# EAGLE design incubator (EAGLE 5.11)
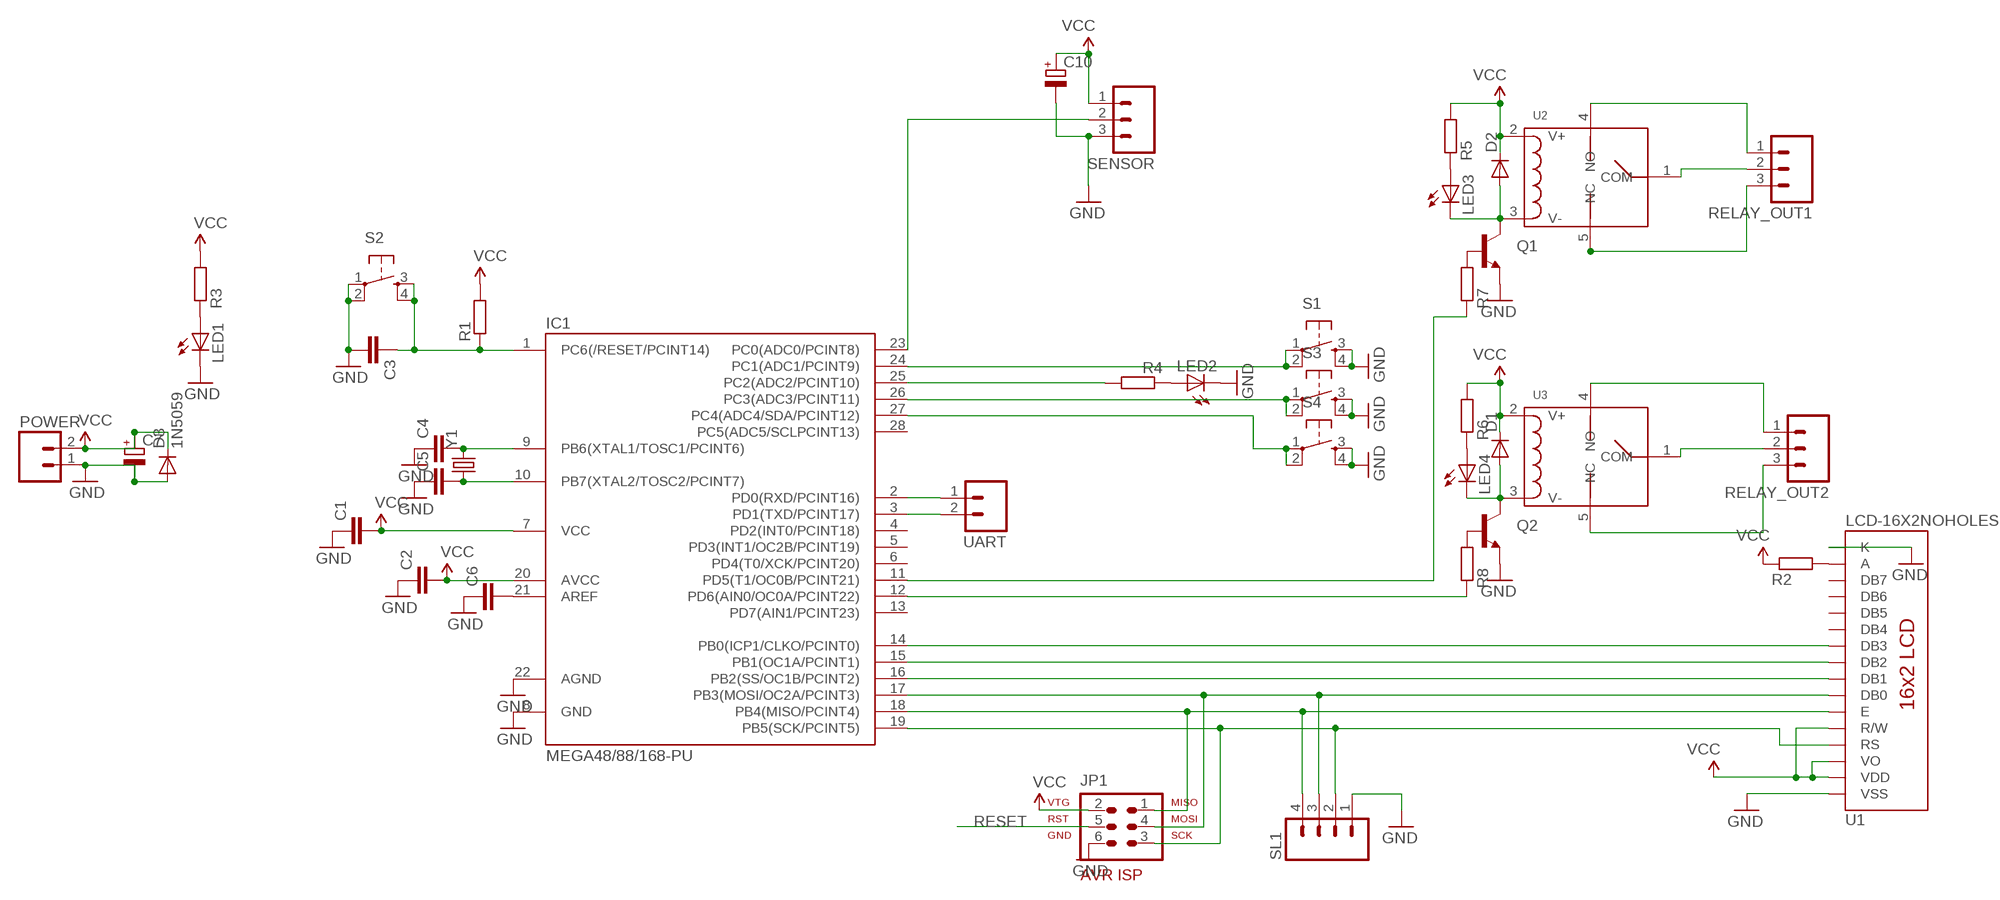
[diagram p0: schematic, sheet 1]

## Parts
C1  C-EUC0603  [C0603]
C2  C-EUC0603  [C0603]
C3  C-EUC0603  [C0603]
C4  C-EUC0805  [C0805]
C5  C-EUC0805  [C0805]
C6  C-EUC0603  [C0603]
C7  CPOL-EUE5-8.5  [E5-8,5]
C10  CPOL-EUE5-8.5  [E5-8,5]
D1  DIODE-MICROMELF-W  [MICROMELF-W]
D2  DIODE-MICROMELF-W  [MICROMELF-W]
D3  1N5059  [DO204-10]
IC1  MEGA48/88/168-PU  [DIL28-3]
JP1  AVR-ISP-6  [AVR-ISP-6]
LED1  LED5MM  [LED5MM]
LED2  LED5MM  [LED5MM]
LED3  LED5MM  [LED5MM]
LED4  LED5MM  [LED5MM]
POWER  M02PTH3  [1X02_LONGPADS]
Q1  TRANSISTOR_NPNSOT23  [SOT23]
Q2  TRANSISTOR_NPNSOT23  [SOT23]
R1  R-EU_R0603  [R0603]
R2  R-EU_R0805  [R0805]
R3  R-EU_R0805  [R0805]
R4  R-EU_R0805  [R0805]
R5  R-EU_R0805  [R0805]
R6  R-EU_R0805  [R0805]
R7  R-EU_R0805  [R0805]
R8  R-EU_R0805  [R0805]
RELAY_OUT1  M03LONGPADS  [1X03_LONGPADS]
RELAY_OUT2  M03LONGPADS  [1X03_LONGPADS]
S1  TAC_SWITCHPTH  [TACTILE-PTH]
S2  TAC_SWITCHPTH  [TACTILE-PTH]
S3  TAC_SWITCHPTH  [TACTILE-PTH]
S4  TAC_SWITCHPTH  [TACTILE-PTH]
SENSOR  M03LONGPADS  [1X03_LONGPADS]
SL1  M04  [04P]
U1  LCD-16X2NOHOLES  [LCD-16X2_NOHOLES]
U2  RELAY  [5P-17X21.6]
U3  RELAY  [5P-17X21.6]
UART  M02PTH3  [1X02_LONGPADS]
Y1  CRYSTALHC49US  [HC49US]

## Nets
GND: C1.1 C2.1 C3.2 C4.1 C5.1 C6.1 C7.- C10.- D3.A IC1.8(GND) IC1.22(AGND) JP1.6 LED1.K(C) LED2.K(C) POWER.1 Q1.2(E) Q2.2(E) S1.3 S1.4 S2.1 S2.2 S3.3 S3.4 S4.3 S4.4 SENSOR.3 SL1.1 U1.1(VSS) U1.16(K)
MISO: IC1.18(PB4(MISO/PCINT4)) JP1.1 SL1.4 U1.6(E)
MOSI: IC1.17(PB3(MOSI/OC2A/PCINT3)) JP1.4 SL1.3 U1.7(DB0)
N$1: IC1.24(PC1(ADC1/PCINT9)) S1.1 S1.2
N$2: C4.2 IC1.9(PB6(XTAL1/TOSC1/PCINT6)) Y1.2
N$3: C5.2 IC1.10(PB7(XTAL2/TOSC2/PCINT7)) Y1.1
N$4: R2.2 U1.15(A)
N$5: C6.2 IC1.21(AREF)
N$9: IC1.16(PB2(SS/OC1B/PCINT2)) U1.8(DB1)
N$10: IC1.15(PB1(OC1A/PCINT1)) U1.9(DB2)
N$11: IC1.14(PB0(ICP1/CLKO/PCINT0)) U1.10(DB3)
N$12: LED1.A R3.1
N$16: IC1.11(PD5(T1/OC0B/PCINT21)) R7.1
N$17: IC1.12(PD6(AIN0/OC0A/PCINT22)) R8.1
N$18: D1.A LED4.K(C) Q2.3(C) U3.3(V-)
N$19: D2.A LED3.K(C) Q1.3(C) U2.3(V-)
N$20: RELAY_OUT1.2 U2.1(COM)
N$21: RELAY_OUT1.1 U2.4(NO)
N$22: RELAY_OUT1.3 U2.5(NC)
N$23: RELAY_OUT2.2 U3.1(COM)
N$24: RELAY_OUT2.1 U3.4(NO)
N$25: RELAY_OUT2.3 U3.5(NC)
N$26: LED2.A R4.1
N$28: LED3.A R5.1
N$29: LED4.A R6.1
N$30: IC1.26(PC3(ADC3/PCINT11)) S3.1 S3.2
N$31: IC1.27(PC4(ADC4/SDA/PCINT12)) S4.1 S4.2
N$32: Q1.1(B) R7.2
N$33: Q2.1(B) R8.2
RESET: C3.1 IC1.1(PC6(/RESET/PCINT14)) JP1.5 R1.1 S2.3 S2.4
RX: IC1.2(PD0(RXD/PCINT16)) UART.1
SCK: IC1.19(PB5(SCK/PCINT5)) JP1.3 SL1.2 U1.4(RS)
STATUS_LED: IC1.25(PC2(ADC2/PCINT10)) R4.2
TEMPERATURE: IC1.23(PC0(ADC0/PCINT8)) SENSOR.2
TX: IC1.3(PD1(TXD/PCINT17)) UART.2
VCC: C1.2 C2.2 C7.+ C10.+ D1.C D2.C D3.C IC1.7(VCC) IC1.20(AVCC) JP1.2 POWER.2 R1.2 R2.1 R3.2 R5.2 R6.2 SENSOR.1 U1.2(VDD) U1.3(VO) U1.5(R/W) U2.2(V+) U3.2(V+)
Unconnected: IC1.4(PD2(INT0/PCINT18)) IC1.5(PD3(INT1/OC2B/PCINT19)) IC1.6(PD4(T0/XCK/PCINT20)) IC1.13(PD7(AIN1/PCINT23)) IC1.28(PC5(ADC5/SCLPCINT13)) U1.11(DB4) U1.12(DB5) U1.13(DB6) U1.14(DB7)

## Library data of the parts
C1-C6 = resistor:C-EU: CAPACITOR, European symbol
C7 C10 = rcl:CPOL-EU: POLARIZED CAPACITOR, European symbol
D1 D2 = diode:DIODE-: DIODE
D3 = diode:1N5059: DIODE controlled avalanche rectifier
IC1 = avr-7:MEGA48/88/168-PU
JP1 = avr-5:AVR-ISP-6: AVR ISP-6 Serial Programming Header
LED1-LED4 = SparkFun:LED: LEDs Standard schematic elements and footprints for 5mm, 3mm, 1206, and 0603 sized LEDs. 5mm - Spark Fun Electronics SKU : COM-00529 (and others)
POWER UART = SparkFun:M02: Header 2 Standard 2-pin 0.1" header. Use with straight break away headers (SKU : PRT-00116), right angle break away headers (PRT-00553), swiss pins (PRT-00743), machine pins (PRT-00117), and female headers (PRT-00115). Molex polarized connector foot print use with SKU : PRT-08233 with associated crimp pins and housings.
Q1 Q2 = SparkFun:TRANSISTOR_NPN: Transistor NPN BJT configuration in SOT23 package. MMBT2222 is the common NPN we use. Double check BCE configuration again layout.
R1-R8 = rcl:R-EU_: RESISTOR, European symbol
RELAY_OUT1 RELAY_OUT2 SENSOR = SparkFun:M03: Header 3 Standard 3-pin 0.1" header. Use with straight break away headers (SKU : PRT-00116), right angle break away headers (PRT-00553), swiss pins (PRT-00743), machine pins (PRT-00117), and female headers (PRT-00115). Molex polarized connector foot print use with SKU : PRT-08232 with associated crimp pins and housings.
S1-S4 = SparkFun:TAC_SWITCH: Momentary Switch Button commonly used for reset or general input. Spark Fun Electronics SKU : COM-00097
SL1 = con-amp-quick:M04: AMP QUICK CONNECTOR; OC_FARNELL: unknown; OC_NEWARK: unknown
U1 = SparkFun:LCD-16X2
U2 U3 = Seeed-Discrete:RELAY
Y1 = SparkFun:CRYSTAL: Crystals Various standard crystals. Proven footprints. Spark Fun Electronics SKU : COM-00534

## Board
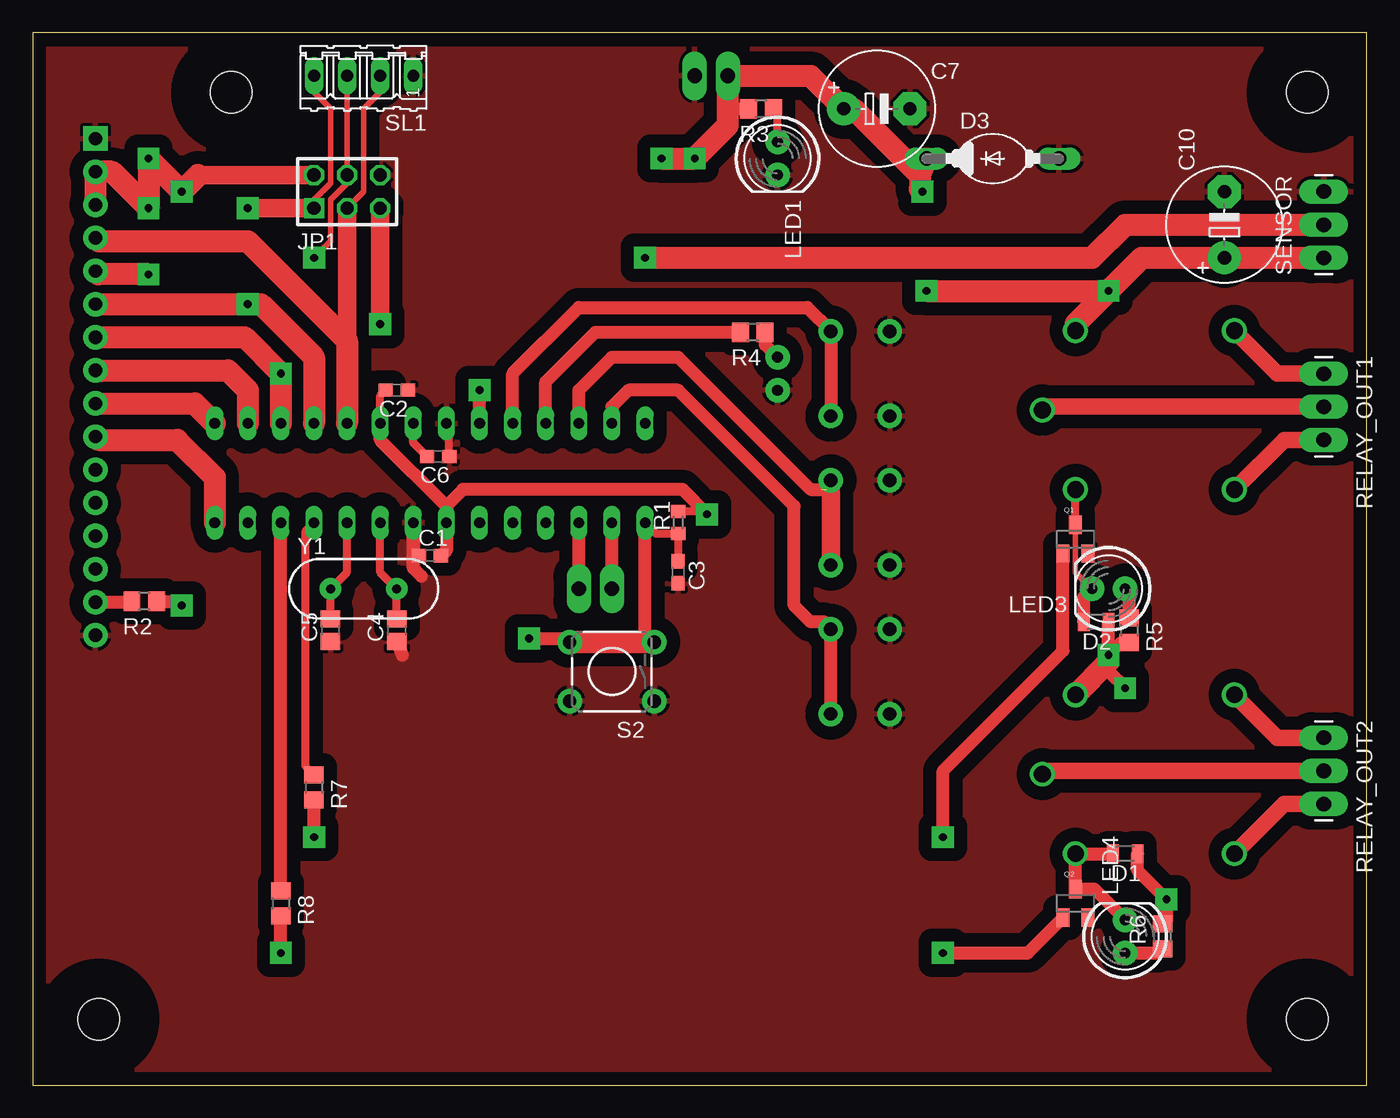
[diagram p1: board, top side]
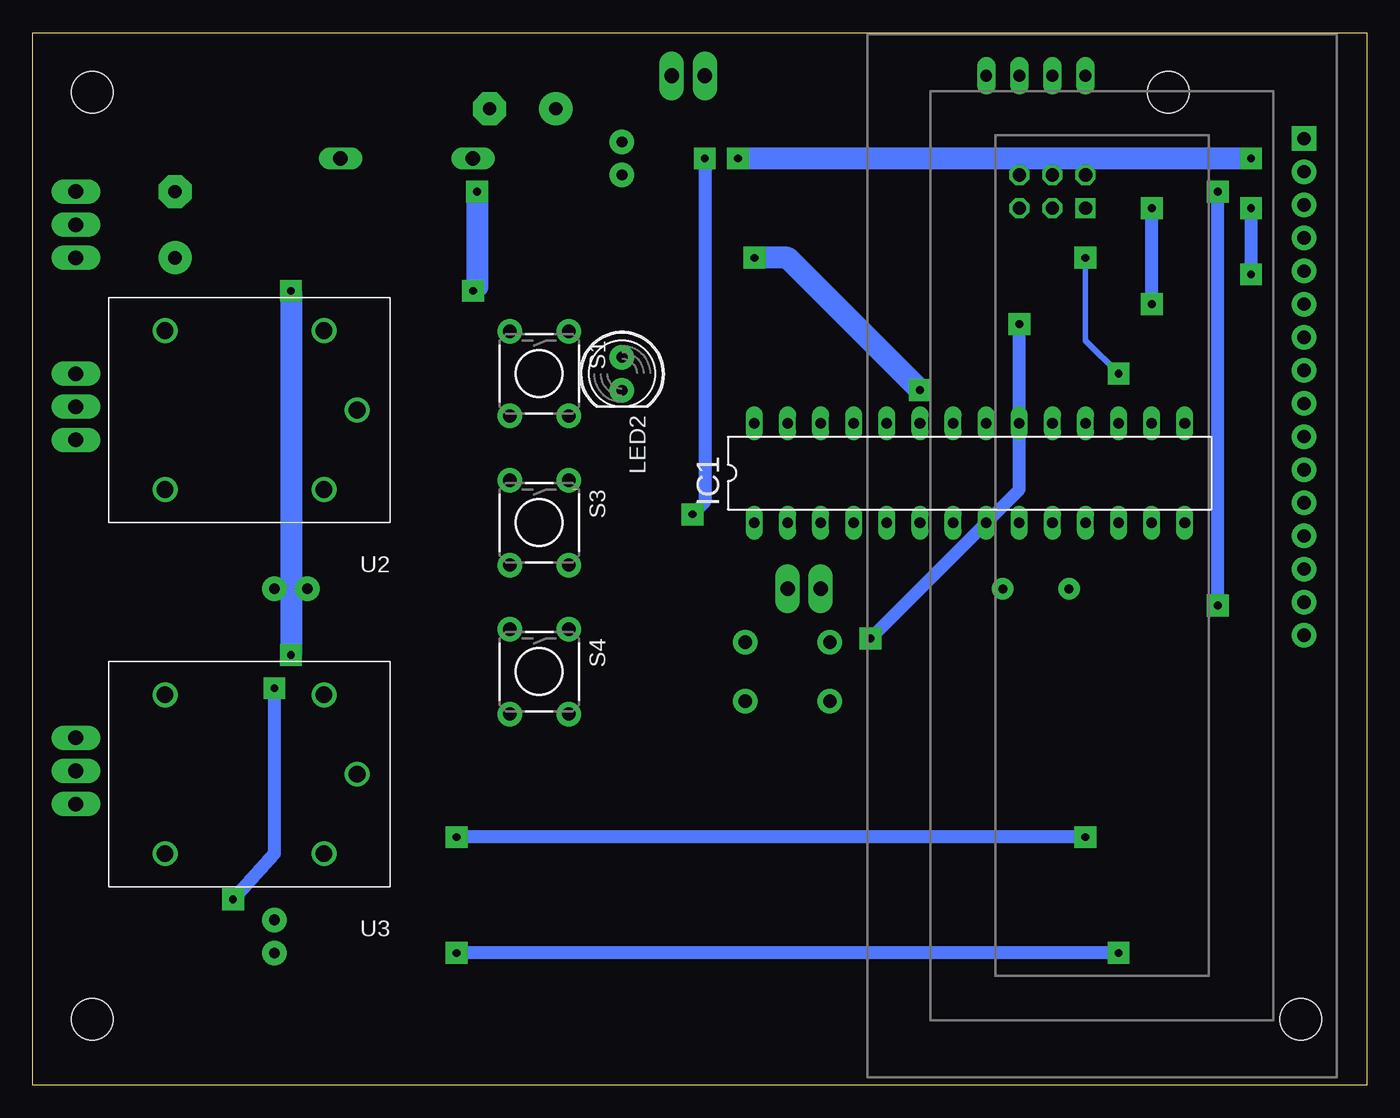
[diagram p2: board, bottom side, seen from below]

Size 102.37 x 80.78 mm. Coordinates in mm from the lower left corner, seen from the top.
Outline: 0,0 102.37,0 102.37,80.78 0,80.78 0,0
Copper layers (1*16): Top 0.035mm / dielectric 1.5mm / Bottom 0.035mm
Design rules "default": minimum track width 10mil, minimum drill 24mil, track to track 8mil, track to pad 8mil, pad to pad 8mil, via to via 8mil, smd to smd 8mil, copper to edge 40mil, drill to drill 8mil, minimum pad ring 10mil, minimum via ring 8mil, stop-mask expansion 4mil, vias tented up to drill 0mil, thermal gap 10mil

### Footprints (pad centres in the part's own frame; a part is rotated, then mirrored left to right if it is on the bottom)
C0603 = smd 1.1 x 1: 1 -0.85,0; 2 0.85,0
C0805 = smd 1.3 x 1.5: 1 -0.85,0; 2 0.85,0
E5-8,5 = drill 1.016 pad 2.54 round: + -2.54,0 | drill 1.016 pad 2.54 octagon: - 2.54,0
MICROMELF-W = smd 0.9 x 1.4: A 0.95,0; C -0.95,0
DO204-10 = drill 1.118 long: A 5.08,0; C -5.08,0
DIL28-3 = drill 0.813 long: 1 -16.51,-3.81; 2 -13.97,-3.81; 3 -11.43,-3.81; 4 -8.89,-3.81; 5 -6.35,-3.81; 6 -3.81,-3.81; 7 -1.27,-3.81; 8 1.27,-3.81; 9 3.81,-3.81; 10 6.35,-3.81; 11 8.89,-3.81; 12 11.43,-3.81; 13 13.97,-3.81; 14 16.51,-3.81; 15 16.51,3.81; 16 13.97,3.81; 17 11.43,3.81; 18 8.89,3.81; 19 6.35,3.81; 20 3.81,3.81; 21 1.27,3.81; 22 -1.27,3.81; 23 -3.81,3.81; 24 -6.35,3.81; 25 -8.89,3.81; 26 -11.43,3.81; 27 -13.97,3.81; 28 -16.51,3.81
AVR-ISP-6 = drill 1.016 square: 1 -2.54,-1.27 | drill 1.016 octagon: 2 -2.54,1.27; 3 0,-1.27; 4 0,1.27; 5 2.54,-1.27; 6 2.54,1.27
LED5MM = drill 0.813 pad 1.88 round: A -1.27,0; K 1.27,0
1X02_LONGPADS = drill 1.118 pad 1.88 long: 1 0,0; 2 2.54,0
SOT23 = smd 1 x 1.4: 1 -0.95,-1.1; 2 0.95,-1.1; 3 0,1.1
R0603 = smd 1 x 1.1: 1 -0.85,0; 2 0.85,0
R0805 = smd 1.3 x 1.5: 1 -0.95,0; 2 0.95,0
1X03_LONGPADS = drill 1.118 pad 1.88 long: 1 0,0; 2 2.54,0; 3 5.08,0
TACTILE-PTH = drill 1.016 pad 1.88 round: 1 -3.251,2.261; 2 3.251,2.261; 3 -3.251,-2.261; 4 3.251,-2.261
04P = drill 0.914 long: 1 -3.81,0; 2 -1.27,0; 3 1.27,0; 4 3.81,0
LCD-16X2_NOHOLES = drill 1.016 pad 1.88 square: 1 -32,15.5 | drill 1.016 pad 1.88 round: 2 -29.46,15.5; 3 -26.92,15.5; 4 -24.38,15.5; 5 -21.84,15.5; 6 -19.3,15.5; 7 -16.76,15.5; 8 -14.22,15.5; 9 -11.68,15.5; 10 -9.14,15.5; 11 -6.6,15.5; 12 -4.06,15.5; 13 -1.52,15.5; 14 1.02,15.5; 15 3.56,15.5; 16 6.1,15.5
5P-17X21.6 = drill 1.27 round: 1 -2.54,-6.096; 2 0,-12.192; 3 0,0; 4 12.192,-12.192; 5 12.192,0
HOLE-3.2/7.0 = hole 3.2: 0,0
HC49US = drill 0.7 pad 1.651 round: 1 -2.54,0; 2 2.54,0

### Placement (x,y rotation side)
C1  30.48,40.64 0 top
C2  27.94,53.34 180 top
C3  49.53,39.37 270 top
C4  27.94,34.92 90 top
C5  22.86,34.92 90 top
C6  31.11,48.26 180 top
C7  64.77,74.93 0 top
C10  91.44,66.04 90 top
D1  83.82,17.78 180 top
D2  81.6,35.56 180 top
D3  73.66,71.12 0 top
IC1  30.48,46.99 0 bottom
JP1  24.13,68.58 0 top
LED1  57.15,71.12 270 top
LED2  57.15,54.61 270 bottom
LED3  82.55,38.1 180 top
LED4  83.82,11.43 90 top
POWER  50.8,77.47 0 top
Q1  80.01,41.91 0 top
Q2  80.01,13.97 0 top
R1  49.53,43.18 90 top
R2  8.57,37.15 180 top
R3  55.88,74.93 180 top
R4  55.24,57.78 180 top
R5  84.14,34.92 270 top
R6  86.68,11.43 90 top
R7  21.59,22.86 270 top
R8  19.05,13.97 270 top
RELAY_OUT1  99.06,54.61 270 top
RELAY_OUT2  99.06,26.67 270 top
S1  63.5,54.61 270 bottom
S2  44.45,31.75 180 top
S3  63.5,43.18 270 bottom
S4  63.5,31.75 270 bottom
SENSOR  99.06,63.5 90 top
SL1  25.4,77.47 180 top
U1  20.32,40.64 270 bottom
U2  80.01,45.72 180 bottom
U3  80.01,17.78 180 bottom
U$1  [HOLE-3.2/7.0]  15.24,76.2 0 top
U$2  [HOLE-3.2/7.0]  97.79,76.2 0 top
U$3  [HOLE-3.2/7.0]  97.79,5.08 0 top
U$4  [HOLE-3.2/7.0]  5.08,5.08 0 top
UART  44.45,38.1 180 top
Y1  25.4,38.1 0 top

### Tracks (layer width: path | path; a pad name or v marks a point on that pad's centre or on a via)
GND
  Top 0.61: C6.1 31.96,50.59 IC1.22
  Top 1.016: C1.1 29.21,41.06 IC1.8 29.21,39.69 29.84,39.05 | C4.1 28.36,33.02
  pour Top (isolate 1.016): 0,0 101.6,0 101.6,80.01 0,80.01
MISO  (via drill 0.6 pad 1.68)
  Top 0.406: JP1.1 21.59,67.94 22.86,69.22 22.86,74.93 21.59,76.2 SL1.4
  Top 1.422: v16.51,67.31 JP1.1
  Top 1.676: IC1.18 21.59,55.88 17.53,59.94 v16.51,59.94 U1.6
  Bottom 1.016: v16.51,59.94 v16.51,67.31
MOSI  (via drill 0.6 pad 1.68)
  Top 0.406: v21.59,63.5 22.86,64.77 22.86,67.94 24.13,69.22 JP1.4 SL1.3
  Top 1.676: IC1.17 v19.05,54.61 16.26,57.4 U1.7
  Bottom 0.406: v21.59,63.5 21.59,57.15 v19.05,54.61
N$1
  Top 1.016: IC1.24 36.83,54.61 41.91,59.69 59.41,59.69 S1.1 S1.2
N$2
  Top 0.61: IC1.9 26.67,39.37 Y1.2 C4.2
N$3
  Top 0.61: IC1.10 24.13,39.37 Y1.1 C5.2
N$4
  Top 1.016: U1.15 7.55,37.08 R2.2
N$5
  Top 0.61: 29.21,51.22 IC1.21 29.21,49.31 C6.2
N$9
  Top 1.676: IC1.16 16.51,53.34 14.99,54.86 U1.8
N$10
  Top 1.676: IC1.15 12.45,52.32 U1.9
N$11
  Top 1.676: IC1.14 13.97,46.67 11.11,49.53 5.07,49.53 U1.10
N$12
  Top 0.61: LED1.A 57.15,74.61 R3.1
N$16
  Top 0.61: IC1.11 20.95,42.55 20.95,24.45 R7.1
N$17
  Top 1.016: R8.1 IC1.12
N$18
  Top 1.016: LED4.K 81.45,15.07 Q2.3 U3.3 D1.A
N$19
  Top 0.406: Q1.3 80.01,39.37 LED3.K
  Top 0.61: Q1.3 U2.3
  Top 1.016: D2.A 80.65,37.47 LED3.K
N$20
  Top 1.27: RELAY_OUT1.2 77.72,52.07 U2.1
N$21
  Top 1.27: RELAY_OUT1.1 95.5,54.61 U2.4
N$22
  Top 1.27: RELAY_OUT1.3 96.01,49.53 U2.5
N$23
  Top 1.27: RELAY_OUT2.2 77.72,24.13 U3.1
N$24
  Top 1.27: RELAY_OUT2.1 95.5,26.67 U3.4
N$25
  Top 1.27: RELAY_OUT2.3 96.01,21.59 U3.5
N$26
  Top 1.016: R4.1 56.2,56.83 LED2.A
N$28
  Top 1.016: R5.1 84.14,37.78 LED3.A
N$29
  Top 1.016: R6.1 86.36,10.16 LED4.A
N$30  (1 unrouted)
  Top 1.016: IC1.26 41.91,53.34 44.45,55.88 49.53,55.88 59.69,45.72 60.53,45.72 S3.1 | 61.24,45.44 60.96,45.72
  Top 1.422: S3.2 61.24,45.44
N$31
  Top 1.016: IC1.27 44.45,52.07 45.72,53.34 49.53,53.34 58.42,44.45 58.42,36.83 59.69,35.56 60.68,35.56 S4.1 S4.2
N$32  (via drill 0.6 pad 1.68)
  Top 1.016: Q1.1 79.06,33.34 69.85,24.13 v69.85,19.05 | v21.59,19.05 R7.2
  Bottom 1.016: v21.59,19.05 v69.85,19.05
N$33  (via drill 0.6 pad 1.68)
  Top 1.016: v69.85,10.16 76.35,10.16 Q2.1 | v19.05,10.16 R8.2
  Bottom 1.016: v19.05,10.16 v69.85,10.16
RESET  (via drill 0.6 pad 1.68)
  Top 0.61: C3.1 R1.1 47.84,42.33 IC1.1
  Top 1.016: 46.99,34.01 IC1.1 | v38.1,34.29 41.63,34.29 41.91,34.01
  Top 1.422: v26.67,58.42 JP1.5
  Top 1.676: S2.4 41.91,34.01 46.99,34.01 S2.3
  Bottom 1.016: v26.67,58.42 26.67,45.72 v38.1,34.29
RX
  Top 1.016: UART.1 IC1.2
SCK
  Top 0.406: JP1.3 25.4,68.58 25.4,74.93 26.67,76.2 SL1.2
  Top 1.016: U1.4
  Top 1.422: 24.13,57.15 JP1.3
  Top 1.676: IC1.19 24.13,57.15 16.51,64.77 5.08,64.77 U1.4
STATUS_LED
  Top 1.016: IC1.25 39.37,53.98 43.18,57.78 R4.2
TEMPERATURE  (via drill 0.6 pad 1.68)
  Top 1.016: IC1.23 v34.29,53.34
  Top 1.676: SENSOR.2 83.82,66.04 81.28,63.5 v46.99,63.5
  Bottom 1.676: v46.99,63.5 44.45,63.5 v34.29,53.34
TX
  Top 1.016: UART.2 IC1.3
VCC  (via drill 0.6 pad 1.68)
  Top 0.61: IC1.20 26.67,52.92 C2.2 | R1.2 51.54,44.03 v51.75,43.81
  Top 1.016: IC1.20 26.67,49.53 31.75,44.45 | U1.3 5.07,67.31 | 31.75,44.45 IC1.7 31.75,41.06 C1.2 | 31.75,44.45 33.02,45.72 49.85,45.72 v51.75,43.81 | R2.1 11.11,37.15 v11.43,36.83 | 53.34,74.93 R3.2 | R5.2 83.5,33.98 v82.55,33.02 | R6.2 87,12.7 v87,14.29 84.77,16.51 D1.C | v83.82,30.48 82.55,31.75 v82.55,33.02 | D2.C v82.55,33.02
  Top 1.422: 12.7,69.85 JP1.2
  Top 1.676: U1.3 U1.2 6.1,70.1 v8.89,67.31 v8.89,71.12 v11.43,68.58 12.7,69.85 | U2.2 80.01,58.42 v82.55,60.96 | v82.55,33.02 82.55,32.51 U3.2 | 68.07,69.85 D3.C | 68.07,69.85 62.99,74.93 C7.+ 59.69,77.47 POWER.2 53.34,74.93 53.34,73.66 v50.8,71.12 v48.26,71.12 | U1.5 5.07,62.23 v8.89,62.23 | SENSOR.1 C10.+ 85.09,63.5 v82.55,60.96 | 68.07,69.85 68.07,68.77 v68.26,68.58 | v68.58,60.96 v82.55,60.96
  Bottom 1.016: v8.89,67.31 v8.89,62.23 | v50.8,71.12 50.8,44.77 v51.75,43.81 | v11.43,36.83 v11.43,68.58 | v87,14.29 83.82,17.78 v83.82,30.48
  Bottom 1.676: v82.55,60.96 v82.55,33.02 | v8.89,71.12 v48.26,71.12 | v68.26,68.58 68.26,61.28 v68.58,60.96